# Altium schematic sheet RTC.SchDoc: RTC Clock
size 533 x 327 mm; ApprovedBy: Yatin Khurana; CheckedBy: Yatin Khurana; DrawnBy: Yatin Khurana; Engineer: Yatin Khurana; Organization: Yatin Khurana; Revision: 2; SheetNumber: 1; SheetTotal: 1; ProjectName: RTC Clock
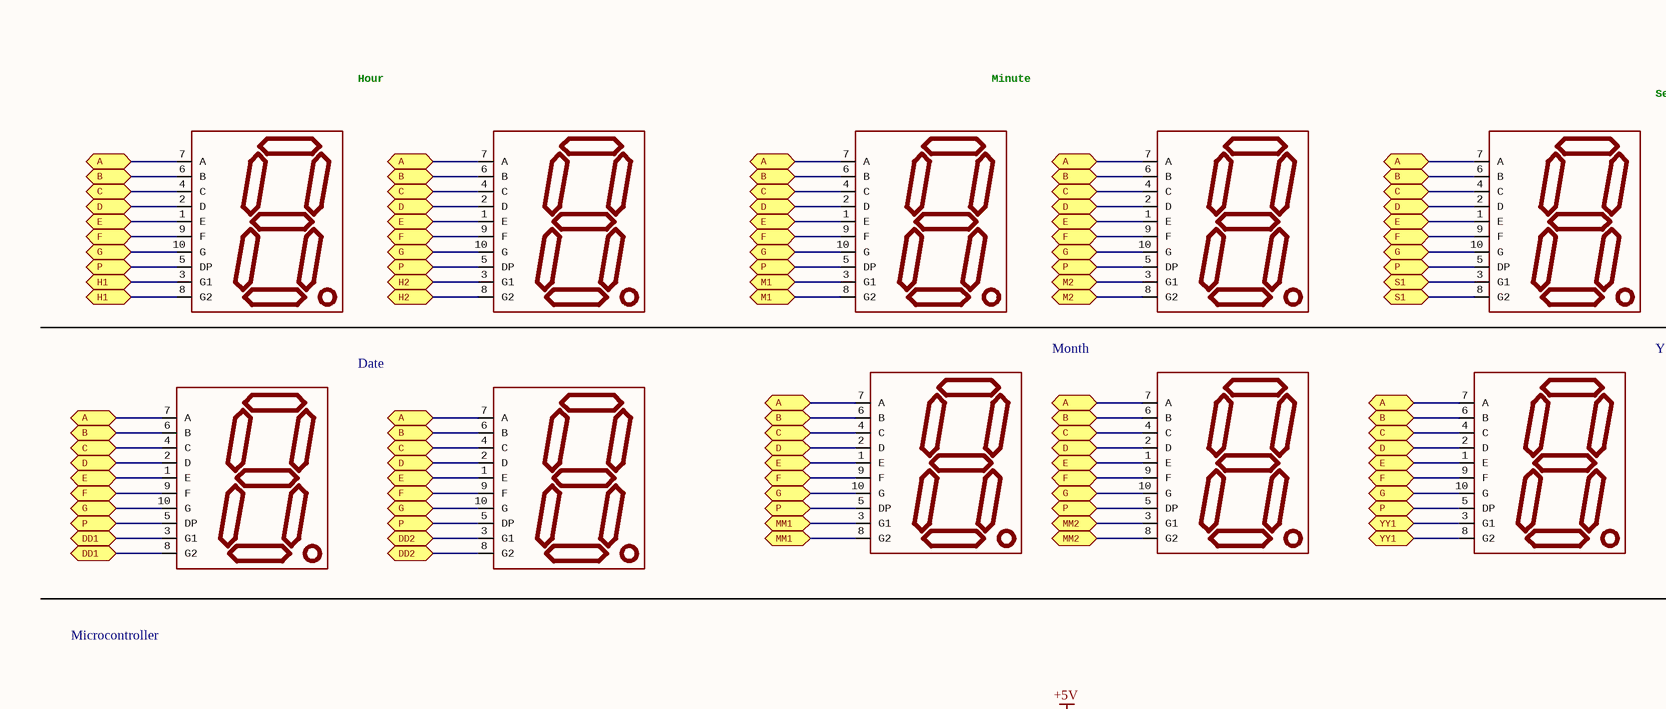
[diagram p0: RTC.SchDoc, top left]
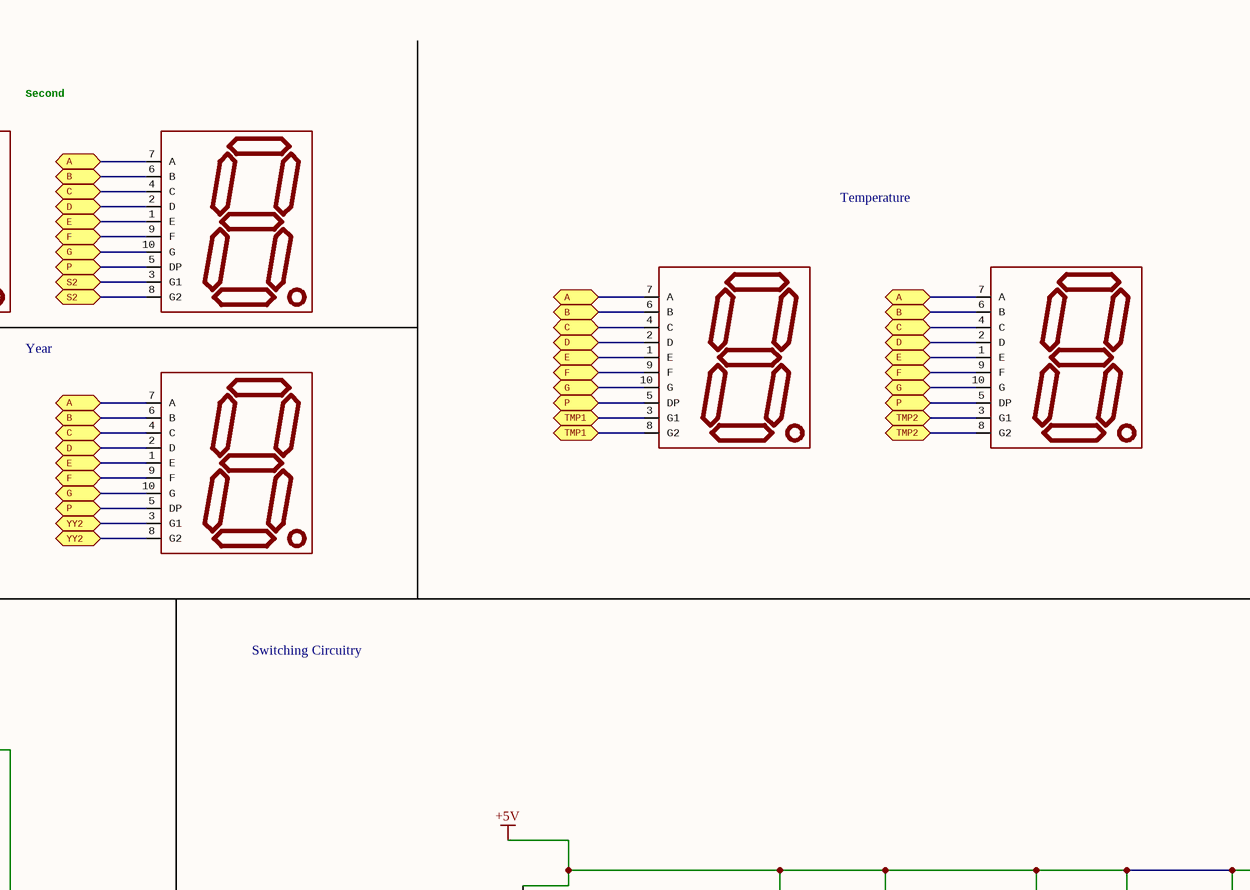
[diagram p1: RTC.SchDoc, top right]
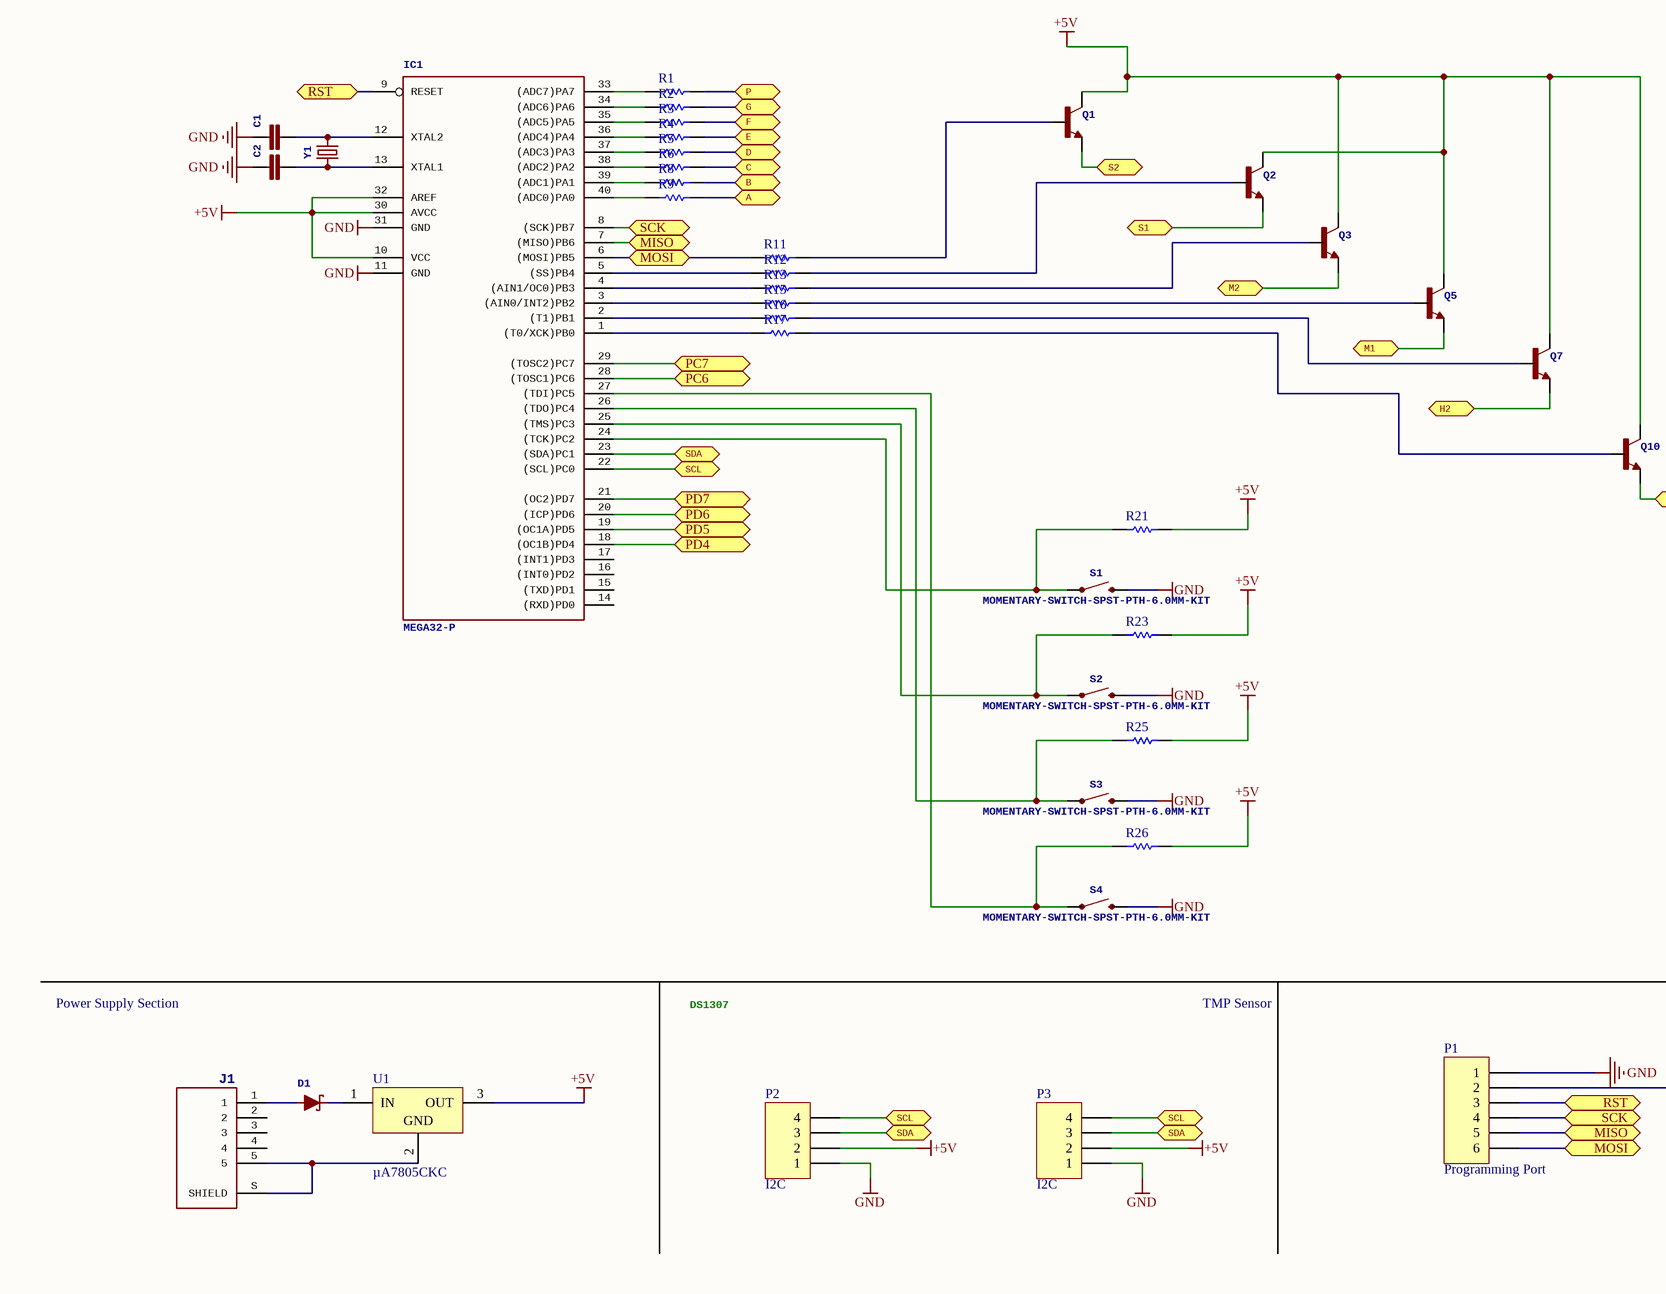
[diagram p2: RTC.SchDoc, bottom left]
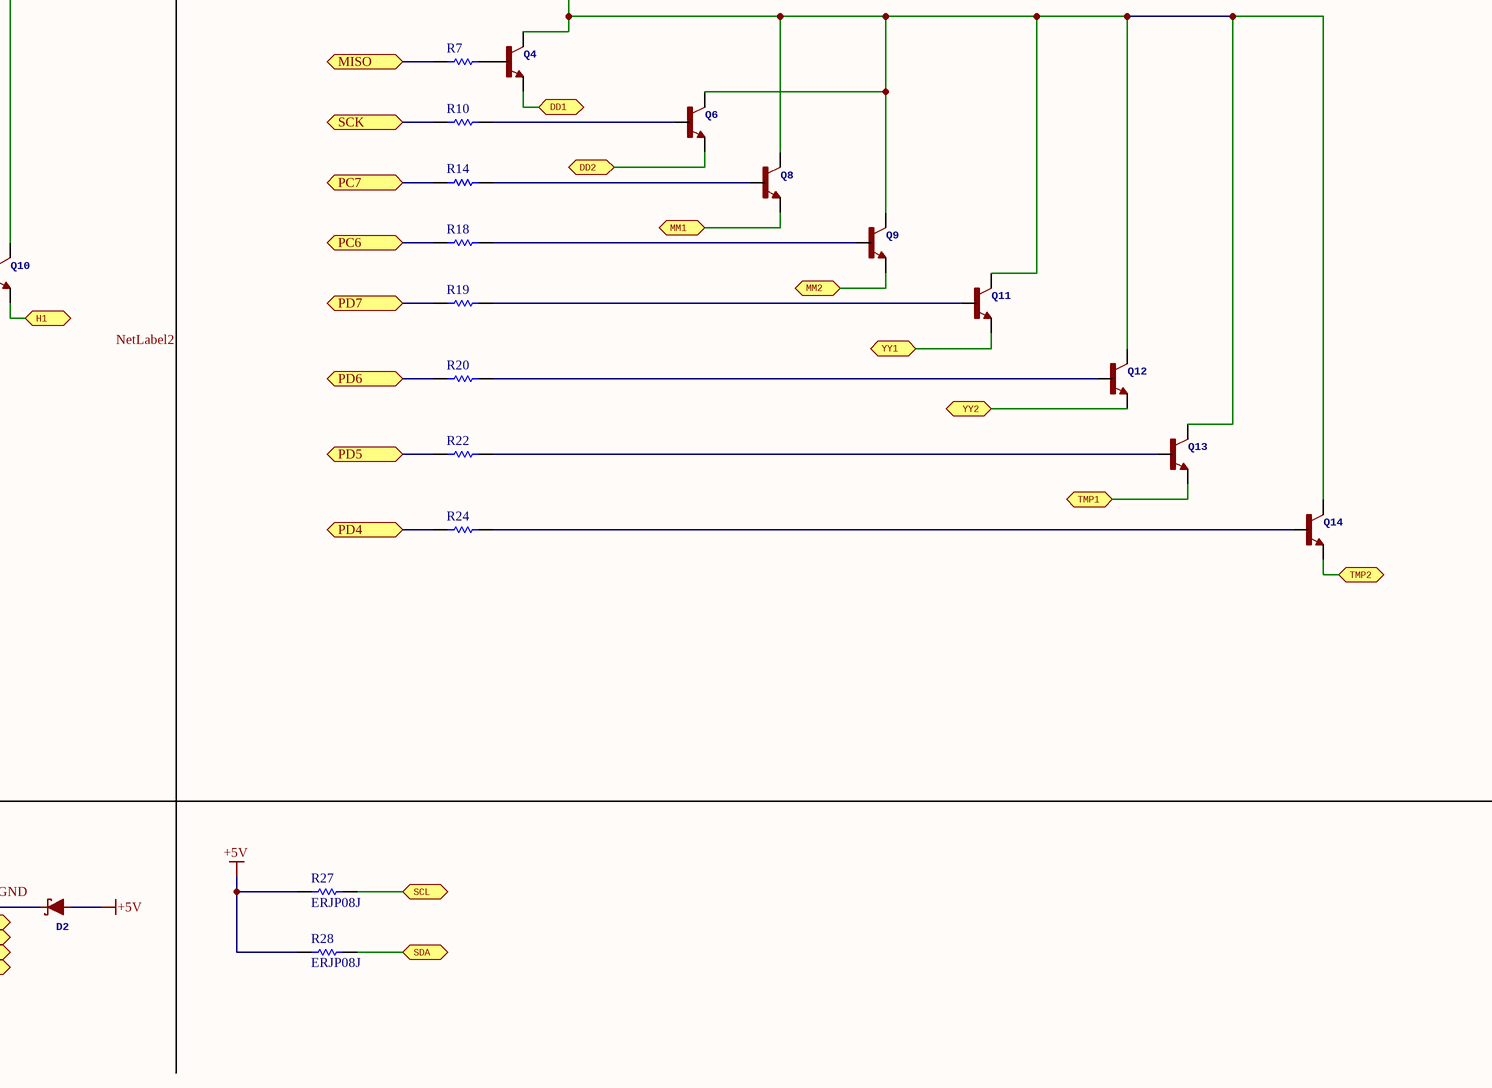
[diagram p3: RTC.SchDoc, bottom right]

## Parts
1  7-SEGMENT-DISPLAYPTH  [7-SEGMENT-DISPLAY]  (value not drawn)
2  7-SEGMENT-DISPLAYPTH  [7-SEGMENT-DISPLAY]  (value not drawn)
3  7-SEGMENT-DISPLAYPTH  [7-SEGMENT-DISPLAY]  (value not drawn)
4  7-SEGMENT-DISPLAYPTH  [7-SEGMENT-DISPLAY]  (value not drawn)
5  7-SEGMENT-DISPLAYPTH  [7-SEGMENT-DISPLAY]  (value not drawn)
6  7-SEGMENT-DISPLAYPTH  [7-SEGMENT-DISPLAY]  (value not drawn)
7  7-SEGMENT-DISPLAYPTH  [7-SEGMENT-DISPLAY]  (value not drawn)
8  7-SEGMENT-DISPLAYPTH  [7-SEGMENT-DISPLAY]  (value not drawn)
9  7-SEGMENT-DISPLAYPTH  [7-SEGMENT-DISPLAY]  (value not drawn)
10  7-SEGMENT-DISPLAYPTH  [7-SEGMENT-DISPLAY]  (value not drawn)
11  7-SEGMENT-DISPLAYPTH  [7-SEGMENT-DISPLAY]  (value not drawn)
12  7-SEGMENT-DISPLAYPTH  [7-SEGMENT-DISPLAY]  (value not drawn)
13  7-SEGMENT-DISPLAYPTH  [7-SEGMENT-DISPLAY]  (value not drawn)
14  7-SEGMENT-DISPLAYPTH  [7-SEGMENT-DISPLAY]  (value not drawn)
C1  22PF-PTH-2.54MM-200V-5%  [CAP-PTH-2.54]  (value not drawn)
C2  22PF-PTH-2.54MM-200V-5%  [CAP-PTH-2.54]  (value not drawn)
D1  Schottky diode    A Schottky diode is a semiconductor diode which has a low forward voltage drop and a very fast switching action.  [SMA-DIODE]  (value not drawn)
D2  Schottky diode    A Schottky diode is a semiconductor diode which has a low forward voltage drop and a very fast switching action.  [SMA-DIODE]  (value not drawn)
IC1  MEGA32-P  [40P6]
J1  SMD+DIP Micro USB; MICRO-B-SMD  [HRS_ZX62D-B-5P8]  (value not drawn)
P1  Programming Port  [HDR1X6]
P2  I2C  [HDR1X4]
P3  I2C  [HDR1X4]
Q1  NPN transistor    Current controlled devices typically used to amplify current or used as a switch.         BC547 -     COM-08928    (TO-92 45V 100mA) (1.Collector 2.Base 3.Emitter)             2N3904 -     COM-00521    (TO-92 40V 200mA) (1.Emitter 2.Base 3.Collector)             P2N2222A -     COM-12852    (TO-92 40V 600mA) (1.Collector 2.Base 3.Emitter)  [SOT23-3]  (value not drawn)
Q2  NPN transistor    Current controlled devices typically used to amplify current or used as a switch.         BC547 -     COM-08928    (TO-92 45V 100mA) (1.Collector 2.Base 3.Emitter)             2N3904 -     COM-00521    (TO-92 40V 200mA) (1.Emitter 2.Base 3.Collector)             P2N2222A -     COM-12852    (TO-92 40V 600mA) (1.Collector 2.Base 3.Emitter)  [SOT23-3]  (value not drawn)
Q3  NPN transistor    Current controlled devices typically used to amplify current or used as a switch.         BC547 -     COM-08928    (TO-92 45V 100mA) (1.Collector 2.Base 3.Emitter)             2N3904 -     COM-00521    (TO-92 40V 200mA) (1.Emitter 2.Base 3.Collector)             P2N2222A -     COM-12852    (TO-92 40V 600mA) (1.Collector 2.Base 3.Emitter)  [SOT23-3]  (value not drawn)
Q4  NPN transistor    Current controlled devices typically used to amplify current or used as a switch.         BC547 -     COM-08928    (TO-92 45V 100mA) (1.Collector 2.Base 3.Emitter)             2N3904 -     COM-00521    (TO-92 40V 200mA) (1.Emitter 2.Base 3.Collector)             P2N2222A -     COM-12852    (TO-92 40V 600mA) (1.Collector 2.Base 3.Emitter)  [SOT23-3]  (value not drawn)
Q5  NPN transistor    Current controlled devices typically used to amplify current or used as a switch.         BC547 -     COM-08928    (TO-92 45V 100mA) (1.Collector 2.Base 3.Emitter)             2N3904 -     COM-00521    (TO-92 40V 200mA) (1.Emitter 2.Base 3.Collector)             P2N2222A -     COM-12852    (TO-92 40V 600mA) (1.Collector 2.Base 3.Emitter)  [SOT23-3]  (value not drawn)
Q6  NPN transistor    Current controlled devices typically used to amplify current or used as a switch.         BC547 -     COM-08928    (TO-92 45V 100mA) (1.Collector 2.Base 3.Emitter)             2N3904 -     COM-00521    (TO-92 40V 200mA) (1.Emitter 2.Base 3.Collector)             P2N2222A -     COM-12852    (TO-92 40V 600mA) (1.Collector 2.Base 3.Emitter)  [SOT23-3]  (value not drawn)
Q7  NPN transistor    Current controlled devices typically used to amplify current or used as a switch.         BC547 -     COM-08928    (TO-92 45V 100mA) (1.Collector 2.Base 3.Emitter)             2N3904 -     COM-00521    (TO-92 40V 200mA) (1.Emitter 2.Base 3.Collector)             P2N2222A -     COM-12852    (TO-92 40V 600mA) (1.Collector 2.Base 3.Emitter)  [SOT23-3]  (value not drawn)
Q8  NPN transistor    Current controlled devices typically used to amplify current or used as a switch.         BC547 -     COM-08928    (TO-92 45V 100mA) (1.Collector 2.Base 3.Emitter)             2N3904 -     COM-00521    (TO-92 40V 200mA) (1.Emitter 2.Base 3.Collector)             P2N2222A -     COM-12852    (TO-92 40V 600mA) (1.Collector 2.Base 3.Emitter)  [SOT23-3]  (value not drawn)
Q9  NPN transistor    Current controlled devices typically used to amplify current or used as a switch.         BC547 -     COM-08928    (TO-92 45V 100mA) (1.Collector 2.Base 3.Emitter)             2N3904 -     COM-00521    (TO-92 40V 200mA) (1.Emitter 2.Base 3.Collector)             P2N2222A -     COM-12852    (TO-92 40V 600mA) (1.Collector 2.Base 3.Emitter)  [SOT23-3]  (value not drawn)
Q10  NPN transistor    Current controlled devices typically used to amplify current or used as a switch.         BC547 -     COM-08928    (TO-92 45V 100mA) (1.Collector 2.Base 3.Emitter)             2N3904 -     COM-00521    (TO-92 40V 200mA) (1.Emitter 2.Base 3.Collector)             P2N2222A -     COM-12852    (TO-92 40V 600mA) (1.Collector 2.Base 3.Emitter)  [SOT23-3]  (value not drawn)
Q11  NPN transistor    Current controlled devices typically used to amplify current or used as a switch.         BC547 -     COM-08928    (TO-92 45V 100mA) (1.Collector 2.Base 3.Emitter)             2N3904 -     COM-00521    (TO-92 40V 200mA) (1.Emitter 2.Base 3.Collector)             P2N2222A -     COM-12852    (TO-92 40V 600mA) (1.Collector 2.Base 3.Emitter)  [SOT23-3]  (value not drawn)
Q12  NPN transistor    Current controlled devices typically used to amplify current or used as a switch.         BC547 -     COM-08928    (TO-92 45V 100mA) (1.Collector 2.Base 3.Emitter)             2N3904 -     COM-00521    (TO-92 40V 200mA) (1.Emitter 2.Base 3.Collector)             P2N2222A -     COM-12852    (TO-92 40V 600mA) (1.Collector 2.Base 3.Emitter)  [SOT23-3]  (value not drawn)
Q13  NPN transistor    Current controlled devices typically used to amplify current or used as a switch.         BC547 -     COM-08928    (TO-92 45V 100mA) (1.Collector 2.Base 3.Emitter)             2N3904 -     COM-00521    (TO-92 40V 200mA) (1.Emitter 2.Base 3.Collector)             P2N2222A -     COM-12852    (TO-92 40V 600mA) (1.Collector 2.Base 3.Emitter)  [SOT23-3]  (value not drawn)
Q14  NPN transistor    Current controlled devices typically used to amplify current or used as a switch.         BC547 -     COM-08928    (TO-92 45V 100mA) (1.Collector 2.Base 3.Emitter)             2N3904 -     COM-00521    (TO-92 40V 200mA) (1.Emitter 2.Base 3.Collector)             P2N2222A -     COM-12852    (TO-92 40V 600mA) (1.Collector 2.Base 3.Emitter)  [SOT23-3]  (value not drawn)
R1  (no value)  [8-1206]
R2  (no value)  [8-1206]
R3  (no value)  [8-1206]
R4  (no value)  [8-1206]
R5  (no value)  [8-1206]
R6  (no value)  [8-1206]
R7  (no value)  [8-1206]
R8  (no value)  [8-1206]
R9  (no value)  [8-1206]
R10  (no value)  [8-1206]
R11  (no value)  [8-1206]
R12  (no value)  [8-1206]
R13  (no value)  [8-1206]
R14  (no value)  [8-1206]
R15  (no value)  [8-1206]
R16  (no value)  [8-1206]
R17  (no value)  [8-1206]
R18  (no value)  [8-1206]
R19  (no value)  [8-1206]
R20  (no value)  [8-1206]
R21  (no value)  [8-1206]
R22  (no value)  [8-1206]
R23  (no value)  [8-1206]
R24  (no value)  [8-1206]
R25  (no value)  [8-1206]
R26  (no value)  [8-1206]
R27  ERJP08J  [8-1206]
R28  ERJP08J  [8-1206]
S1  MOMENTARY-SWITCH-SPST-PTH-6.0MM-KIT  [TACTILE_SWITCH_PTH_6.0MM_KIT]
S2  MOMENTARY-SWITCH-SPST-PTH-6.0MM-KIT  [TACTILE_SWITCH_PTH_6.0MM_KIT]
S3  MOMENTARY-SWITCH-SPST-PTH-6.0MM-KIT  [TACTILE_SWITCH_PTH_6.0MM_KIT]
S4  MOMENTARY-SWITCH-SPST-PTH-6.0MM-KIT  [TACTILE_SWITCH_PTH_6.0MM_KIT]
U1  µA7805CKC  [KC03]
Y1  CRYSTAL-16MHZPTH-HC49US  [HC49US]  (value not drawn)

## Ports
A, B, C, D, DD1, DD2, E, F, G, H1, H2, M1, M2, MISO, MM1, MM2, MOSI, P, PC6, PC7, PD4, PD5, PD6, PD7, RST, S1, S2, SCK, SCL, SDA, TMP1, TMP2, YY1, YY2

## Nets
+5V: D2.A IC1.10(VCC) IC1.30(AVCC) IC1.32(AREF) P2.2 P3.2 Q1.3(C) Q2.3(C) Q3.3(C) Q4.3(C) Q5.3(C) Q6.3(C) Q7.3(C) Q8.3(C) Q9.3(C) Q10.3(C) Q11.3(C) Q12.3(C) Q13.3(C) Q14.3(C) R21.2 R23.2 R25.2 R26.2 R27.1 R28.1 U1.3(OUT)
GND: C1.1 C2.1 IC1.11(GND) IC1.31(GND) P1.1 P2.1 P3.1 S1.3 S2.3 S3.3 S4.3
A: 1.7(A) 2.7(A) 3.7(A) 4.7(A) 5.7(A) 6.7(A) 7.7(A) 8.7(A) 9.7(A) 10.7(A) 11.7(A) 12.7(A) 13.7(A) 14.7(A) R9.2 ; port A
B: 1.6(B) 2.6(B) 3.6(B) 4.6(B) 5.6(B) 6.6(B) 7.6(B) 8.6(B) 9.6(B) 10.6(B) 11.6(B) 12.6(B) 13.6(B) 14.6(B) R8.2 ; port B
C: 1.4(C) 2.4(C) 3.4(C) 4.4(C) 5.4(C) 6.4(C) 7.4(C) 8.4(C) 9.4(C) 10.4(C) 11.4(C) 12.4(C) 13.4(C) 14.4(C) R6.2 ; port C
D: 1.2(D) 2.2(D) 3.2(D) 4.2(D) 5.2(D) 6.2(D) 7.2(D) 8.2(D) 9.2(D) 10.2(D) 11.2(D) 12.2(D) 13.2(D) 14.2(D) R5.2 ; port D
DD1: 13.3(G1) 13.8(G2) Q4.2(E) ; port DD1
DD2: 14.3(G1) 14.8(G2) Q6.2(E) ; port DD2
E: 1.1(E) 2.1(E) 3.1(E) 4.1(E) 5.1(E) 6.1(E) 7.1(E) 8.1(E) 9.1(E) 10.1(E) 11.1(E) 12.1(E) 13.1(E) 14.1(E) R4.2 ; port E
F: 1.9(F) 2.9(F) 3.9(F) 4.9(F) 5.9(F) 6.9(F) 7.9(F) 8.9(F) 9.9(F) 10.9(F) 11.9(F) 12.9(F) 13.9(F) 14.9(F) R3.2 ; port F
G: 1.10(G) 2.10(G) 3.10(G) 4.10(G) 5.10(G) 6.10(G) 7.10(G) 8.10(G) 9.10(G) 10.10(G) 11.10(G) 12.10(G) 13.10(G) 14.10(G) R2.2 ; port G
H1: 1.3(G1) 1.8(G2) Q10.2(E) ; port H1
H2: 2.3(G1) 2.8(G2) Q7.2(E) ; port H2
M1: 3.3(G1) 3.8(G2) Q5.2(E) ; port M1
M2: 4.3(G1) 4.8(G2) Q3.2(E) ; port M2
MISO: IC1.7((MISO)PB6) P1.5 R7.1 ; port MISO
MM1: 9.3(G1) 9.8(G2) Q8.2(E) ; port MM1
MM2: 10.3(G1) 10.8(G2) Q9.2(E) ; port MM2
MOSI: IC1.6((MOSI)PB5) P1.6 R11.1 ; port MOSI
P: 1.5(DP) 2.5(DP) 3.5(DP) 4.5(DP) 5.5(DP) 6.5(DP) 7.5(DP) 8.5(DP) 9.5(DP) 10.5(DP) 11.5(DP) 12.5(DP) 13.5(DP) 14.5(DP) R1.2 ; port P
PC6: IC1.28((TOSC1)PC6) R18.1 ; port PC6
PC7: IC1.29((TOSC2)PC7) R14.1 ; port PC7
PD4: IC1.18((OC1B)PD4) R24.1 ; port PD4
PD5: IC1.19((OC1A)PD5) R22.1 ; port PD5
PD6: IC1.20((ICP)PD6) R20.1 ; port PD6
PD7: IC1.21((OC2)PD7) R19.1 ; port PD7
RST: IC1.9(RESET) P1.3 ; port RST
S1: 5.3(G1) 5.8(G2) Q2.2(E) ; port S1
S2: 6.3(G1) 6.8(G2) Q1.2(E) ; port S2
SCK: IC1.8((SCK)PB7) P1.4 R10.1 ; port SCK
SCL: IC1.22((SCL)PC0) P2.4 P3.4 R27.2 ; port SCL
SDA: IC1.23((SDA)PC1) P2.3 P3.3 R28.2 ; port SDA
TMP1: 7.3(G1) 7.8(G2) Q13.2(E) ; port TMP1
TMP2: 8.3(G1) 8.8(G2) Q14.2(E) ; port TMP2
YY1: 11.3(G1) 11.8(G2) Q11.2(E) ; port YY1
YY2: 12.3(G1) 12.8(G2) Q12.2(E) ; port YY2
NetC1_2: C1.2 IC1.12(XTAL2) Y1.2
NetC2_2: C2.2 IC1.13(XTAL1) Y1.1
NetD1_A: D1.A J1.1
NetD1_C: D1.C U1.1(IN)
NetD2_C: D2.C P1.2
NetIC1_1: IC1.1((T0/XCK)PB0) R17.1
NetIC1_2: IC1.2((T1)PB1) R16.1
NetIC1_3: IC1.3((AIN0/INT2)PB2) R15.1
NetIC1_4: IC1.4((AIN1/OC0)PB3) R13.1
NetIC1_5: IC1.5((SS)PB4) R12.1
NetIC1_24: IC1.24((TCK)PC2) R21.1 S1.1
NetIC1_25: IC1.25((TMS)PC3) R23.1 S2.1
NetIC1_26: IC1.26((TDO)PC4) R25.1 S3.1
NetIC1_27: IC1.27((TDI)PC5) R26.1 S4.1
NetIC1_33: IC1.33((ADC7)PA7) R1.1
NetIC1_34: IC1.34((ADC6)PA6) R2.1
NetIC1_35: IC1.35((ADC5)PA5) R3.1
NetIC1_36: IC1.36((ADC4)PA4) R4.1
NetIC1_37: IC1.37((ADC3)PA3) R5.1
NetIC1_38: IC1.38((ADC2)PA2) R6.1
NetIC1_39: IC1.39((ADC1)PA1) R8.1
NetIC1_40: IC1.40((ADC0)PA0) R9.1
NetJ1_5: J1.5 J1.S(SHIELD) U1.2(GND)
NetQ1_1: Q1.1(B) R11.2
NetQ2_1: Q2.1(B) R12.2
NetQ3_1: Q3.1(B) R13.2
NetQ4_1: Q4.1(B) R7.2
NetQ5_1: Q5.1(B) R15.2
NetQ6_1: Q6.1(B) R10.2
NetQ7_1: Q7.1(B) R16.2
NetQ8_1: Q8.1(B) R14.2
NetQ9_1: Q9.1(B) R18.2
NetQ10_1: Q10.1(B) R17.2
NetQ11_1: Q11.1(B) R19.2
NetQ12_1: Q12.1(B) R20.2
NetQ13_1: Q13.1(B) R22.2
NetQ14_1: Q14.1(B) R24.2

Not connected (* = marked no-connect by the designer): IC1 14((RXD)PD0) 15((TXD)PD1) 16((INT0)PD2) 17((INT1)PD3); J1 2 3 4

## Notes on the sheet
- Hour
- Minute
- Second
- Temperature
- Date
- Month
- Year
- Microcontroller
- Switching Circuitry
- Power Supply Section
- DS1307
- TMP Sensor
- Labels drawn without touching a wire or pin: NetLabel2

## Library data of the parts
C1 C2 = 22PF-PTH-2.54MM-200V-5%: PROD_ID: CAP-09128
D1 D2 = DIODE-SCHOTTKY-SS14: PROD_ID: DIO-08053
IC1 = MEGA32-P: MICROCONTROLLER   32 Kbytes FLASH 2 Kbytes SRAM 1 Kbytes EEPROM USART 8-channel 10 bit ADC Source: www.atmel.com .. doc2503.pdf; MPN: ATMEGA32-16PU; MF: *; OC_FARNELL: 1661729; OC_NEWARK: 51P1794
J1 = ZX62D-B-5P8: MF: Hirose; Price: None; MP: ZX62D-B-5P8; Availability: Unavailable; Package: None
P1 = Header 6: Header, 6-Pin; LatestRevisionDate: 17-Jul-2002; LatestRevisionNote: Re-released for DXP Platform.; Publisher: Altium Limited
P2 P3 = Header 4: Header, 4-Pin; LatestRevisionDate: 17-Jul-2002; LatestRevisionNote: Re-released for DXP Platform.; Publisher: Altium Limited
Q1-Q14 = TRANS_NPN-MMBT2222AL: PROD_ID: TRANS-08049
R1-R28 = ERJP08J: Anti-Surge Thick Film Chip Resistor, 10 Ohm to 1M Ohm Range, 5% Tolerance, 1206 Size, 0.25 W; Note: If flow soldering, adjust pad width of PCB Footprint to 0.7 - 0.8 times the width of the resistor.; Published: 17-Dec-2003; LatestRevisionDate: 19-Mar-2004; LatestRevisionNote: Silkscreen size reduced.; PackageDocument: Mar-2003; PackageReference: 8-1206; Publisher: Altium Limited; Code_IPC: 3216 [1206]; ComponentLink1Description: Manufacturer Link; ComponentLink1URL: http://www.panasonic.com/industrial/components/resistive_products.htm; ComponentLink2Description: Datasheet; ComponentLink2URL: http://www.panasonic.com/industrial/components/pdf/AOA0000CE4.pdf
S1-S4 = MOMENTARY-SWITCH-SPST-PTH-6.0MM-KIT: PROD_ID: SWCH-08441; SF_SKU: COM-00097
U1 = µA7805CKC: Positive-Voltage Regulator; Note: Pin 2 is electrically connected to TAB.; Published: 15-Apr-2002; DatasheetVersion: Jul-1999; PackageVersion: Sep-1995; PackageReference: KC03; Publisher: Altium Limited; PackageDescription: TO, Thru-Hole, Vertical, Heatsink Mounted; 3 In-Line Leads; Pitch 2.54 mm; ComponentLink1Description: Manufacturer Link; ComponentLink1URL: http://www.ti.com/; ComponentLink2Description: Datasheet; ComponentLink2URL: http://www-s.ti.com/sc/ds/ua7805.pdf
Y1 = CRYSTAL-16MHZPTH-HC49US: PROD_ID: XTAL-08181; SF_ID: COM-00536